# EAGLE design ziffy_board_v3 (EAGLE 6.4)
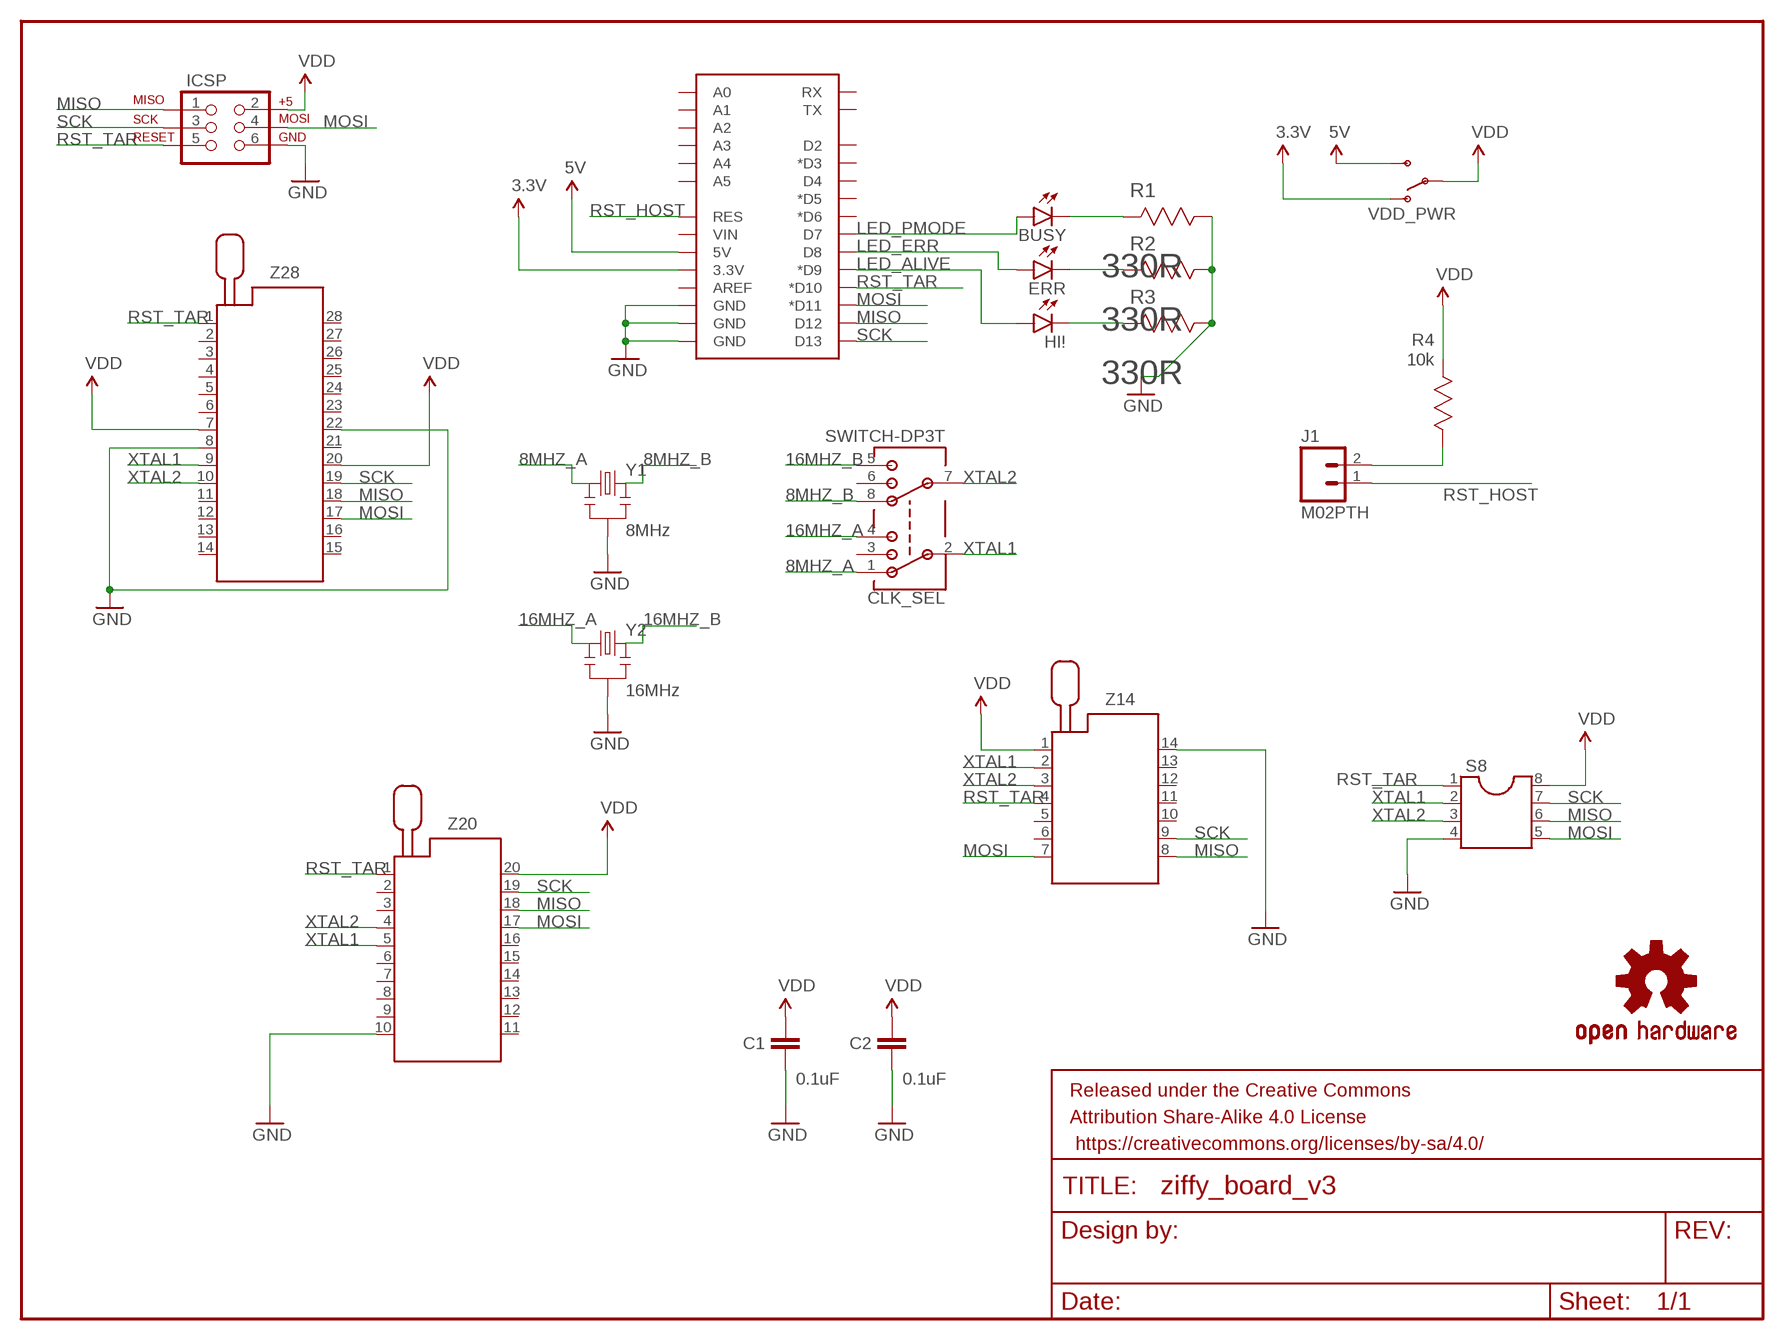
[diagram p0: schematic, sheet 1]

## Parts
BUSY  YELLOW  LED3MM  [LED3MM]
C1  0.1uF  CAPPTH2  [CAP-PTH-SMALL2]
C2  0.1uF  CAPPTH2  [CAP-PTH-SMALL2]
CLK_SEL  SWITCH-DP3T  [SWITCH-DP3T]
ERR  RED  LED3MM  [LED3MM]
FRAME1  FRAME-LETTER  [CREATIVE_COMMONS]
HI!  GREEN  LED3MM  [LED3MM]
ICSP  AVR_SPI_PRG_6PTH  [2X3]
J1  M02PTH  [1X02]
LOGO2  OSHW-LOGOS  [OSHW-LOGO-S]
R1  330R  RESISTOR_PTH_0.2  [AXIAL-0.2]
R2  330R  RESISTOR_PTH_0.2  [AXIAL-0.2]
R3  330R  RESISTOR_PTH_0.2  [AXIAL-0.2]
R4  10k  RESISTOR_PTH_0.2  [AXIAL-0.2]
S8  DIPSHIT  DIL8  [DIL08]
U$1  ARDUINO_SHIELDOUTLINE_NOHOLES  [ARDUINO_SHIELD_OUTLINE_NOHOLES]
VDD_PWR  SPDT  SWITCH-SPDTPTH  [SWITCH-SPDT]
Y1  8MHz  RESONATORPTH  [RESONATOR-PTH]
Y2  16MHz  RESONATORPTH  [RESONATOR-PTH]
Z14  ZIF14  [ZIF14]
Z20  ZIF20  [ZIF20]
Z28  ZIF28  [ZIF28]

## Nets
3.3V: U$1.3.3V VDD_PWR.1(O)
5V: U$1.5V VDD_PWR.3(S)
8MHZ_A: CLK_SEL.1 Y1.1
8MHZ_B: CLK_SEL.8 Y1.3
16MHZ_A: CLK_SEL.4 Y2.1
16MHZ_B: CLK_SEL.5 Y2.3
GND: C1.2 C2.2 ICSP.6 R1.P$1 R2.P$1 R3.P$1 S8.4 U$1.GND@0(GND) U$1.GND@1(GND) U$1.GND@2(GND) Y1.2 Y2.2 Z14.14 Z20.10 Z28.8 Z28.22
LED_ALIVE: HI!.A U$1.D9(*D9)
LED_ERR: ERR.A U$1.D8
LED_PMODE: BUSY.A U$1.D7
MISO: ICSP.1 S8.6 U$1.D12 Z14.8 Z20.18 Z28.18
MOSI: ICSP.4 S8.5 U$1.D11(*D11) Z14.7 Z20.17 Z28.17
N$1: BUSY.K(C) R1.P$2
N$2: ERR.K(C) R2.P$2
N$3: HI!.K(C) R3.P$2
N$4: J1.2 R4.P$1
RST_HOST: J1.1 U$1.RES
RST_TAR: ICSP.5 S8.1 U$1.D10(*D10) Z14.4 Z20.1 Z28.1
SCK: ICSP.3 S8.7 U$1.D13 Z14.9 Z20.19 Z28.19
VDD: C1.1 C2.1 ICSP.2 R4.P$2 S8.8 VDD_PWR.2(P) Z14.1 Z20.20 Z28.7 Z28.20
XTAL1: CLK_SEL.2 S8.2 Z14.2 Z20.5 Z28.9
XTAL2: CLK_SEL.7 S8.3 Z14.3 Z20.4 Z28.10
Unconnected: CLK_SEL.3 CLK_SEL.6 U$1.A0 U$1.A1 U$1.A2 U$1.A3 U$1.A4 U$1.A5 U$1.AREF U$1.D2 U$1.D3(*D3) U$1.D4 U$1.D5(*D5) U$1.D6(*D6) U$1.RX U$1.TX U$1.VIN Z14.5 Z14.6 Z14.10 Z14.11 Z14.12 Z14.13 Z20.2 Z20.3 Z20.6 Z20.7 Z20.8 Z20.9 Z20.11 Z20.12 Z20.13 Z20.14 Z20.15 Z20.16 Z28.2 Z28.3 Z28.4 Z28.5 Z28.6 Z28.11 Z28.12 Z28.13 Z28.14 Z28.15 Z28.16 Z28.21 Z28.23 Z28.24 Z28.25 Z28.26 Z28.27 Z28.28

## Library data of the parts
BUSY ERR HI! = butts:LED: LEDs Standard schematic elements and footprints for 5mm, 3mm, 1206, and 0603 sized LEDs. 5mm - Spark Fun Electronics SKU : COM-00529 (and others)
C1 C2 = SparkFun-Capacitors:CAP: Capacitor Standard 0603 ceramic capacitor, and 0.1" leaded capacitor.
CLK_SEL = butts:SWITCH-DP3T
FRAME1 = SparkFun-Aesthetics:FRAME-LETTER: Schematic Frame Standard 8.5x11 US Letter frame
ICSP = SparkFun-Connectors:AVR_SPI_PRG_6: AVR ISP 6 Pin This is the reduced ISP connector for AVR programming. Common on Arduino. This footprint will take up less PCB space and can be used with a 10-pin to 6-pin adapter such as SKU: BOB-08508 **Special note about "TEST_POINT" package. The stop mask is on the top side, so if you want your programming test points to be on the bottom of your board, make sure to place this package on the bottom side of the board. This also ensure that the orientation to program from the bottom side will be correct.
J1 = SparkFun-Connectors:M02: Standard 2-pin 0.1" header. Use with - straight break away headers ( PRT-00116) - right angle break away headers (PRT-00553) - swiss pins (PRT-00743) - machine pins (PRT-00117) - female headers (PRT-00115) Molex polarized connector foot print use with: PRT-08233 with associated crimp pins and housings. 2.54_SCREWTERM for use with PRT-10571. 3.5mm Screw Terminal footprints for PRT-08084 5mm Screw Terminal footprints for use with PRT-08433
LOGO2 = SparkFun-Aesthetics:OSHW-LOGO: Open Source Hardware Logo This logo indicates the piece of hardware it is found on incorporates a OSHW license and/or adheres to the definition of open source hardware found here: http://freedomdefined.org/OSHW
R1-R4 = butts:RESISTOR_PTH_0.2
S8 = butts:DIL8: Dual In Line / Socket
U$1 = butts:ARDUINO_SHIELD: Arduino shield footprint
VDD_PWR = SparkFun-Electromechanical:SWITCH-SPDT: SPDT Switch Simple slide switch, Spark Fun Electronics SKU : COM-00102 DPDT SMT slide switch, AYZ0202, SWCH-08179
Y1 Y2 = SparkFun-FreqCtrl:RESONATOR: Resonator Small SMD resonator. Used, eg, on the Arduino Pro/ Pro Mini boards. 8MHz- XTAL-08895 16MHz- XTAL-08900
Z14 = butts:ZIF14: Zero Insertion Force Socked Source: http://www.3M.com/ehpd; MF: 3M; MPN: 214-3339-00-0602J; OC_FARNELL: 1247151; OC_NEWARK: 85K7793
Z20 = butts:ZIF20: Zero Insertion Force Socked Source: http://www.3M.com/ehpd; MF: 3M; MPN: 220-3342-00-0602J; OC_FARNELL: 9897445; OC_NEWARK: 85K7807
Z28 = butts:ZIF28: Zero Insertion Force Socked Source: http://www.3M.com/ehpd

## Board
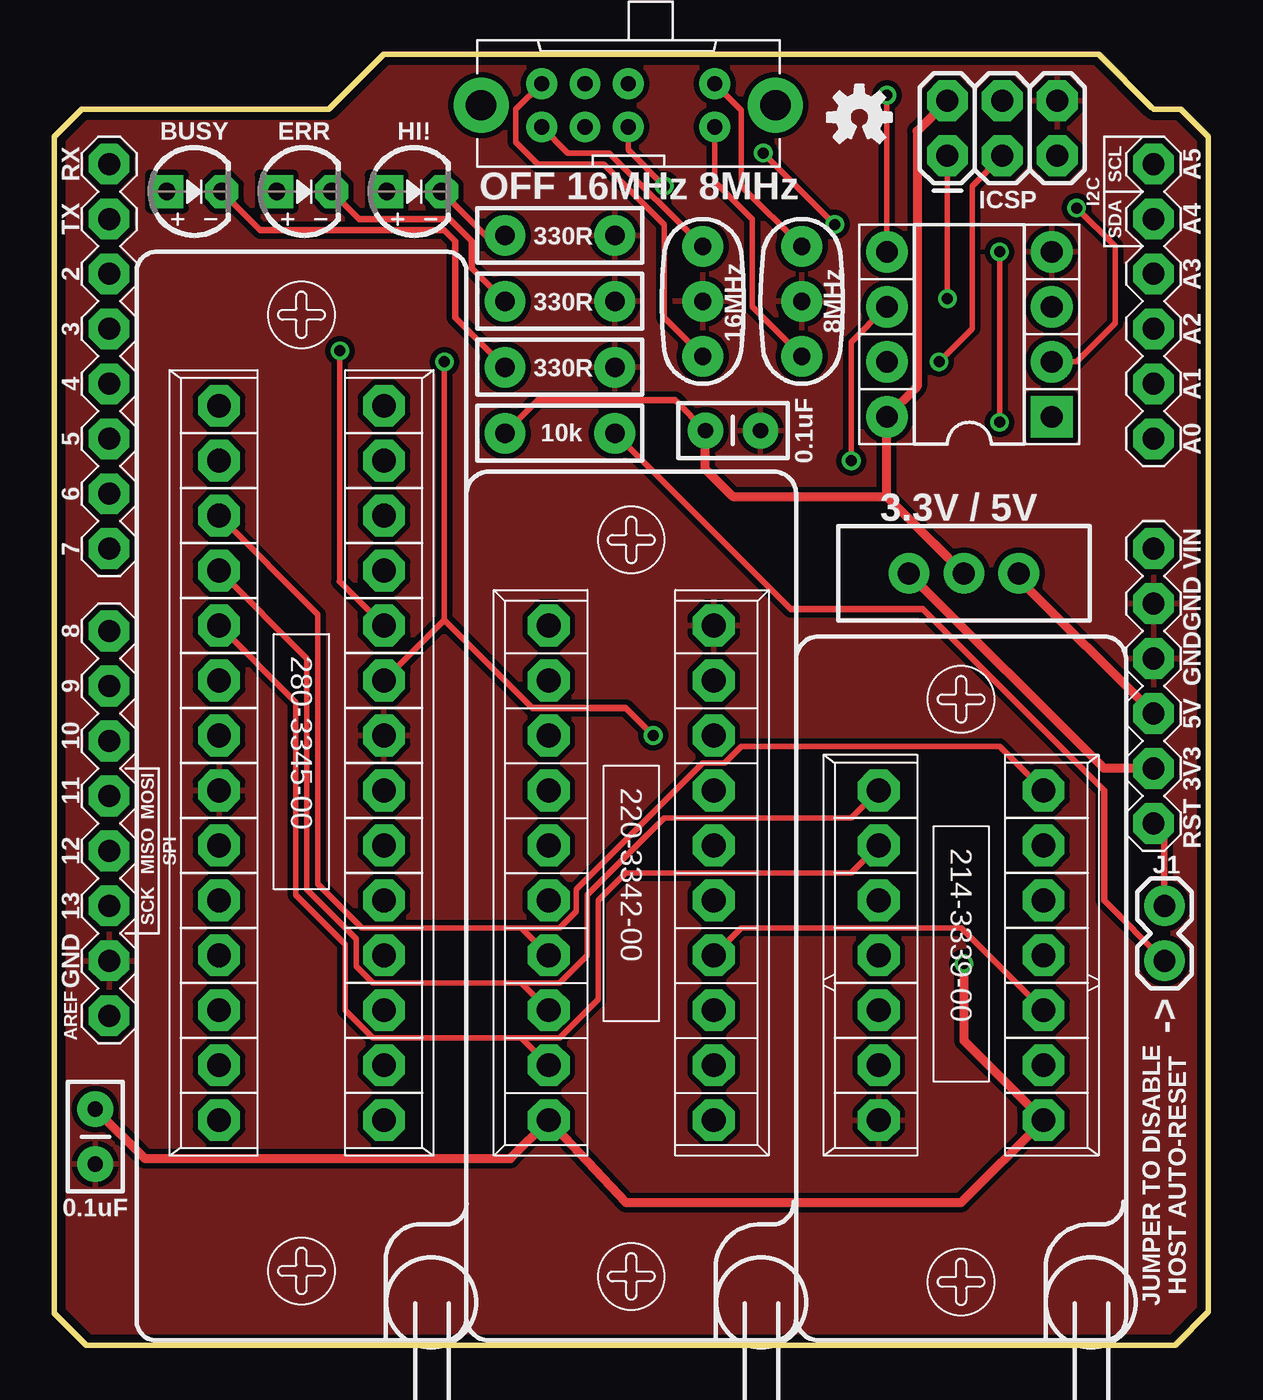
[diagram p1: board, top side]
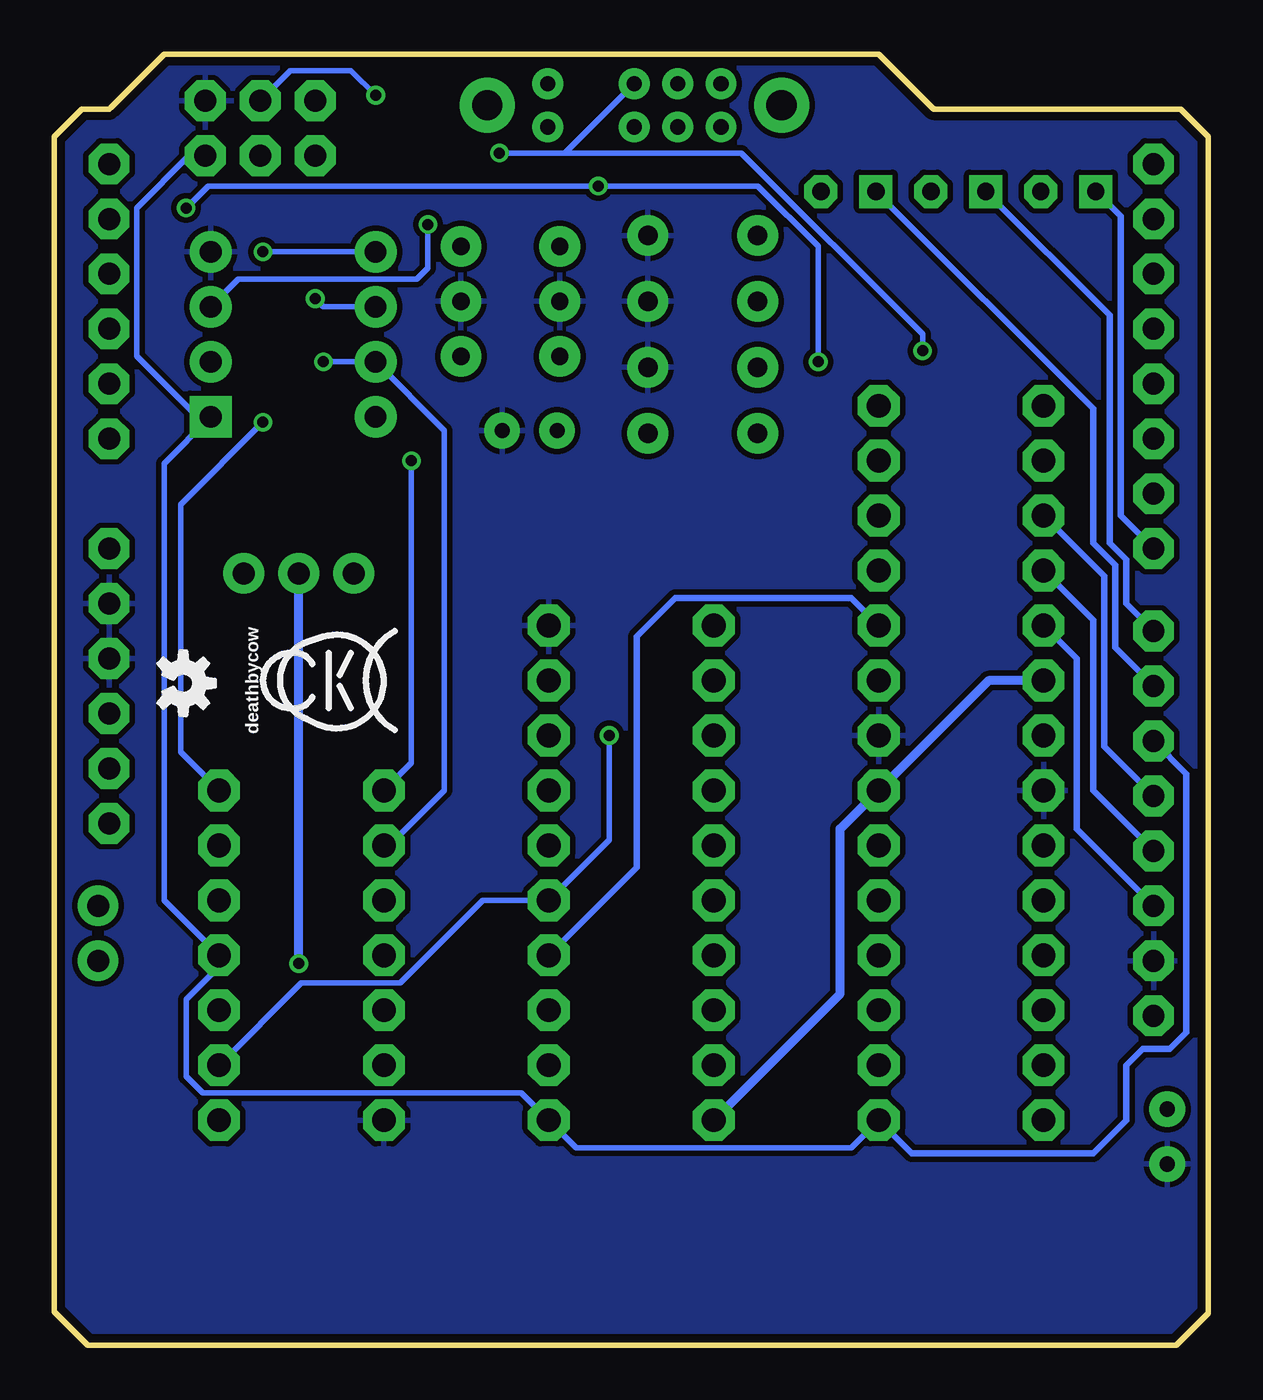
[diagram p2: board, bottom side, seen from below]

Size 53.34 x 59.69 mm. Coordinates in mm from the lower left corner, seen from the top.
Copper layers (1*16): Top 0.0356mm / dielectric 1.5011mm / Bottom 0.0356mm
Design rules "LaenPCBOrder *": minimum track width 6mil, minimum drill 13mil, track to track 6mil, track to pad 6mil, pad to pad 6mil, via to via 6mil, smd to smd 6mil, copper to edge 15mil, drill to drill 6mil, minimum pad ring 7mil, minimum via ring 7mil, stop-mask expansion 3mil, vias tented up to drill 21mil, thermal gap 10mil

### Footprints (pad centres in the part's own frame; a part is rotated, then mirrored left to right if it is on the bottom)
LED3MM = drill 0.8 pad 1.524 square: A -1.27,0 | drill 0.8 pad 1.524 octagon: K 1.27,0
CAP-PTH-SMALL2 = drill 0.7 pad 1.651: 1 0,0; 2 2.54,0
SWITCH-DP3T = drill 0.7 pad 1.422: 1 3,4; 2 7,4; 3 9,4; 4 11,4; 5 11,2; 6 9,2; 7 7,2; 8 3,2 | drill 1.4 pad 2.54: MT1 0.2,3; MT3 13.8,3
2X3 = drill 1.016 pad 1.88 octagon: 1 0,0; 2 0,2.54; 3 2.54,0; 4 2.54,2.54; 5 5.08,0; 6 5.08,2.54
1X02 = drill 1.016 pad 1.88: 1 0,0; 2 2.54,0
AXIAL-0.2 = drill 0.9 pad 1.88: P$1 -2.54,0; P$2 2.54,0
DIL08 = drill 1 pad 1.93 square: 1 -3.81,-3.81 | drill 1 pad 1.93: 2 -1.27,-3.81; 3 1.27,-3.81; 4 3.81,-3.81; 5 3.81,3.81; 6 1.27,3.81; 7 -1.27,3.81; 8 -3.81,3.81
ARDUINO_SHIELD_OUTLINE_NOHOLES = drill 1.016 pad 1.88 octagon: 3.3V 50.8,26.67; 5V 50.8,29.21; A0 50.8,41.91; A1 50.8,44.45; A2 50.8,46.99; A3 50.8,49.53; A4 50.8,52.07; A5 50.8,54.61; AREF 2.54,15.24; D2 2.54,49.53; D3 2.54,46.99; D4 2.54,44.45; D5 2.54,41.91; D6 2.54,39.37; D7 2.54,36.83; D8 2.54,33.02; D9 2.54,30.48; D10 2.54,27.94; D11 2.54,25.4; D12 2.54,22.86; D13 2.54,20.32; GND@0 50.8,31.75; GND@1 50.8,34.29; GND@2 2.54,17.78; RES 50.8,24.13; RX 2.54,54.61; TX 2.54,52.07; VIN 50.8,36.83
SWITCH-SPDT = drill 1.016 pad 1.88: 1 0,2.54; 2 0,0; 3 0,-2.54
RESONATOR-PTH = drill 0.8 pad 1.88: 1 -2.54,0; 2 0,0; 3 2.54,0
ZIF14 = drill 1.1 pad 1.93 octagon: 1 -7.62,-3.81; 2 -5.08,-3.81; 3 -2.54,-3.81; 4 0,-3.81; 5 2.54,-3.81; 6 5.08,-3.81; 7 7.62,-3.81; 8 7.62,3.81; 9 5.08,3.81; 10 2.54,3.81; 11 0,3.81; 12 -2.54,3.81; 13 -5.08,3.81; 14 -7.62,3.81
ZIF20 = drill 1.1 pad 1.93 octagon: 1 -11.43,-3.81; 2 -8.89,-3.81; 3 -6.35,-3.81; 4 -3.81,-3.81; 5 -1.27,-3.81; 6 1.27,-3.81; 7 3.81,-3.81; 8 6.35,-3.81; 9 8.89,-3.81; 10 11.43,-3.81; 11 11.43,3.81; 12 8.89,3.81; 13 6.35,3.81; 14 3.81,3.81; 15 1.27,3.81; 16 -1.27,3.81; 17 -3.81,3.81; 18 -6.35,3.81; 19 -8.89,3.81; 20 -11.43,3.81
ZIF28 = drill 1.1 pad 1.93 octagon: 1 -16.51,-3.81; 2 -13.97,-3.81; 3 -11.43,-3.81; 4 -8.89,-3.81; 5 -6.35,-3.81; 6 -3.81,-3.81; 7 -1.27,-3.81; 8 1.27,-3.81; 9 3.81,-3.81; 10 6.35,-3.81; 11 8.89,-3.81; 12 11.43,-3.81; 13 13.97,-3.81; 14 16.51,-3.81; 15 16.51,3.81; 16 13.97,3.81; 17 11.43,3.81; 18 8.89,3.81; 19 6.35,3.81; 20 3.81,3.81; 21 1.27,3.81; 22 -1.27,3.81; 23 -3.81,3.81; 24 -6.35,3.81; 25 -8.89,3.81; 26 -11.43,3.81; 27 -13.97,3.81; 28 -16.51,3.81

### Placement (x,y rotation side)
BUSY  6.48,53.34 0 top
C1  1.91,10.92 270 top
C2  30.1,42.29 0 top
CLK_SEL  33.53,60.33 180 top
ERR  11.56,53.34 0 top
FRAME1  2.92,61.98 0 top
HI!  16.64,53.34 0 top
ICSP  41.28,54.99 0 top
J1  51.31,20.32 270 top
LOGO1  OSHW-LOGOS  [OSHW-LOGO-S]  47.37,30.61 270 bottom
LOGO2  37.21,56.77 0 top
R1  23.37,45.21 180 top
R2  23.37,48.26 180 top
R3  23.37,51.31 180 top
R4  23.37,42.16 180 top
S8  42.29,46.74 90 top
U$1  0,0 0 top
U$3  [COW_SMALL]  40.13,30.73 270 bottom
VDD_PWR  42.04,35.69 90 top
Y1  34.54,48.26 90 top
Y2  29.97,48.26 270 top
Z14  41.91,18.03 90 top
Z20  26.67,21.84 90 top
Z28  11.43,26.92 90 top

### Tracks (layer width: path | path; a pad name or v marks a point on that pad's centre or on a via)
3.3V
  Top 0.406: U$1.3.3V 48.51,26.67 VDD_PWR.1
5V
  Top 0.406: U$1.5V 44.58,35.43 VDD_PWR.3
8MHZ_A
  Top 0.254: CLK_SEL.1 30.53,53.8 32.26,52.07 32.26,48.01 Y1.1
8MHZ_B
  Top 0.254: CLK_SEL.8 31.75,57.1 31.75,53.59 Y1.3
16MHZ_A
  Top 0.254: CLK_SEL.4 23.73,55.12 25.65,55.12 Y2.1
16MHZ_B
  Top 0.254: CLK_SEL.5 21.34,57.13 21.34,55.63 22.35,54.61 25.4,54.61 28.19,51.82 28.19,47.5 Y2.3
GND
  pour Top (isolate 0.254): 0,55.88 1.27,57.15 12.7,57.15 15.24,59.69 48.26,59.69 50.8,57.15 52.07,57.15 53.34,55.88 53.34,1.52 51.82,0 1.52,0 0,1.52
  pour Bottom (isolate 0.254): 0,55.88 1.27,57.15 12.7,57.15 15.24,59.69 48.26,59.69 50.8,57.15 52.07,57.15 53.34,55.88 53.34,1.52 51.82,0 1.52,0 0,1.52
LED_ALIVE
  Bottom 0.305: U$1.D9 4.32,32.26 4.32,36.07 5.33,37.08 5.33,43.31 HI!.A
LED_ERR
  Bottom 0.305: U$1.D8 3.81,34.29 3.81,36.32 4.57,37.08 4.57,47.62 ERR.A
LED_PMODE
  Bottom 0.305: U$1.D7 4.06,38.35 4.06,52.2 BUSY.A
MISO  (via drill 0.51)
  Top 0.254: Z28.18 11.68,31.75 11.68,21.08 13.97,18.8 13.97,17.53 14.73,16.76 21.59,16.76 | S8.6 38.46,48.01 36.83,46.38 v36.83,40.89 | ICSP.1 v41.28,48.39 | Z14.8 36.83,24.38 28.19,24.38 24.64,20.83 24.64,18.03 23.37,16.76 21.59,16.76 | 21.59,16.76 Z20.18
  Bottom 0.254: Z14.8 36.83,26.92 v36.83,40.89 | S8.6 40.89,48.01 v41.28,48.39
  Bottom 0.305: Z28.18 5.33,33.53 5.33,25.65 U$1.D12
MOSI  (via drill 0.51)
  Top 0.254: Z28.17 12.19,33.78 12.19,21.34 14.22,19.3 21.59,19.3 | S8.5 v38.48,57.78 | v43.69,50.55 v43.69,42.67 | Z14.7 43.69,27.69 31.75,27.69 30.99,26.92 29.97,26.92 24.13,21.08 24.13,20.07 23.37,19.3 21.59,19.3 | Z20.17 21.59,19.3
  Bottom 0.254: Z14.7 47.5,27.43 47.5,38.86 v43.69,42.67 | v38.48,57.78 39.62,58.93 42.42,58.93 ICSP.4 | S8.5 v43.69,50.55
  Bottom 0.305: Z28.17 4.83,35.56 4.83,27.69 U$1.D11
N$1
  Top 0.305: BUSY.K 9.52,51.56 18.03,51.56 18.54,51.05 18.54,47.5 R1.P$2
N$2
  Top 0.305: ERR.K 14.1,52.07 18.29,52.07 19.3,51.05 19.3,49.78 R2.P$2
N$3
  Top 0.305: R3.P$2 19.94,51.31 HI!.K
N$4
  Top 0.305: J1.2 48.51,20.57 48.51,25.65 40.13,34.04 34.04,34.04 R4.P$1
RST_HOST
  Top 0.305: J1.1 51.31,23.62 U$1.RES
RST_TAR
  Bottom 0.254: Z28.1 16.51,9.14 29.21,9.14 Z20.1 31.75,11.68 46.48,11.68 47.24,12.45 47.24,16 45.72,17.53 Z14.4 48.26,20.57 48.26,40.77 S8.1 46.74,42.93 49.53,45.72 49.53,52.58 47.12,54.99 ICSP.5
  Bottom 0.305: U$1.D10 1.02,26.42 1.02,14.48 1.78,13.72 3.05,13.72 3.81,12.95 3.81,10.41 5.33,8.89 13.72,8.89 Z28.1
SCK  (via drill 0.51)
  Top 0.254: Z28.19 11.18,29.72 11.18,20.83 13.46,18.54 13.46,15.49 14.73,14.22 21.34,14.22 21.59,14.22 | v40.89,45.47 42.42,46.99 42.42,53.59 ICSP.3 | Z14.9 36.83,21.84 26.42,21.84 25.15,20.57 25.15,16 23.37,14.22 21.59,14.22 | 21.59,14.22 Z20.19
  Bottom 0.254: Z14.9 37.85,23.11 35.31,25.65 35.31,42.29 S8.7 v40.89,45.47
  Bottom 0.305: Z28.19 6.1,31.75 6.1,23.88 U$1.D13
VDD  (via drill 0.51)
  Top 0.305: R4.P$2 22.35,43.69 28.7,43.69 C2.1
  Top 0.406: 38.48,39.24 VDD_PWR.2 40.64,37.08 | 38.48,39.24 S8.8 39.88,44.32 39.88,56.13 ICSP.2 | 38.48,39.24 31.37,39.24 30.1,40.51 C2.1 | C1.1 4.19,8.64 21.08,8.64 Z20.20 26.42,6.6 41.91,6.6 Z14.1 42.04,14.1 v42.04,17.65
  Bottom 0.406: v42.04,17.65 VDD_PWR.2 | Z20.20 17.02,16.26 17.02,23.88 Z28.7 10.16,30.73 Z28.20
XTAL1  (via drill 0.51)
  Top 0.254: CLK_SEL.2 26.53,55.26 v28.19,53.59 | v47.24,52.58 49.02,50.8 49.02,47.24 47.24,45.47 S8.2 | 18.03,33.53 v18.03,45.47
  Top 0.305: v27.69,28.19 26.42,29.46 22.1,29.46 18.03,33.53 Z28.9
  Bottom 0.254: v27.69,28.19 27.69,23.37 Z20.5 33.53,20.57 37.34,16.76 41.91,16.76 Z14.2 | v18.03,45.47 18.03,50.8 20.83,53.59 v28.19,53.59 46.23,53.59 v47.24,52.58
XTAL2  (via drill 0.51)
  Top 0.254: 13.21,35.31 v13.21,45.97 | v32.77,55.12 v36.07,51.82 | Z20.4 31.75,19.3 41.91,19.3 Z14.3
  Top 0.305: Z28.10 13.21,35.31
  Bottom 0.254: v13.21,45.97 13.21,46.74 21.59,55.12 29.73,55.12 | Z20.4 26.42,22.1 | S8.3 44.83,49.28 36.58,49.28 36.07,49.78 v36.07,51.82 | CLK_SEL.7 29.73,55.12 | 29.73,55.12 v32.77,55.12
  Bottom 0.305: 26.42,22.1 26.42,32.77 24.64,34.54 16.51,34.54 Z28.10

### Text on the board
tPlace: OFF 16MHz 8MHz | 3.3V / 5V | -> | JUMPER TO DISABLE / HOST AUTO-RESET
Reference: schizobovine <sean@yak.net>